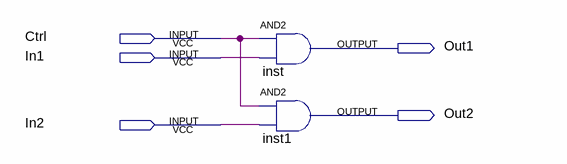
[diagram p0: schematic sheet]
// Quartus schematic Enable2.bdf as structural Verilog: 2 symbols, 5 pins
module Enable2 (
  input  Ctrl,
  input  In1,
  input  In2,
  output Out1,
  output Out2
);

  and inst (Out1, Ctrl, In1);
  and inst1 (Out2, Ctrl, In2);
endmodule
